# Altium schematic sheet Main_line_in.SchDoc
size A4
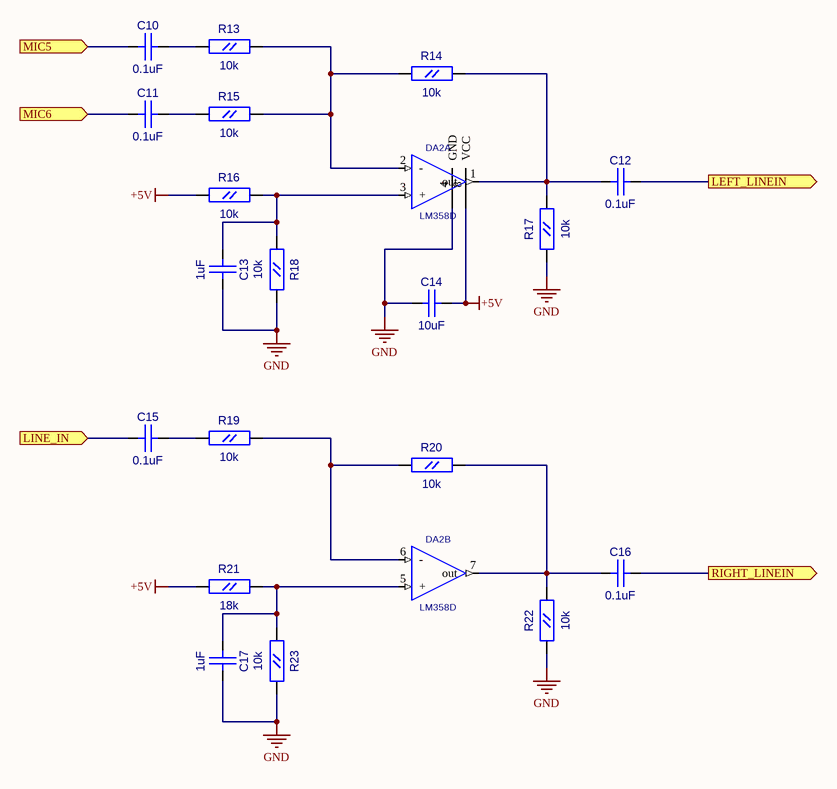
[diagram p0: Main_line_in.SchDoc]

## Parts
C10  0.1uF  [CC0603]
C11  0.1uF  [CC0603]
C12  0.1uF  [CC0603]
C13  1uF  [CC0603]
C14  10uF  [CC0805]
C15  0.1uF  [CC0603]
C16  0.1uF  [CC0603]
C17  1uF  [CC0603]
DA2  LM358D  [SO-8]  (parts A,B of 2)
R13  10k  [RC0603]
R14  10k  [RC0603]
R15  10k  [RC0603]
R16  10k  [RC0603]
R17  10k  [RC0603]
R18  10k  [RC0603]
R19  10k  [RC0603]
R20  10k  [RC0603]
R21  18k  [RC0603]
R22  10k  [RC0603]
R23  10k  [RC0603]

## Ports
LEFT_LINEIN (out), LINE_IN (in), MIC5 (in), MIC6 (in), RIGHT_LINEIN (out)

## Nets
+5V: C14.2(B) DA2.8(VCC) R16.1(A) R21.1(A)
GND: C13.2(B) C14.1(A) C17.2(B) DA2.4(GND) R17.1(A) R18.2(B) R22.1(A) R23.2(B)
LEFT_LINEIN: C12.2(B) ; port LEFT_LINEIN
LINE_IN: C15.1(A) ; port LINE_IN
MIC5: C10.1(A) ; port MIC5
MIC6: C11.1(A) ; port MIC6
RIGHT_LINEIN: C16.2(B) ; port RIGHT_LINEIN
NetC10_2: C10.2(B) R13.1(A)
NetC11_2: C11.2(B) R15.1(A)
NetC12_1: C12.1(A) DA2.1(out) R14.2(B) R17.2(B)
NetC13_1: C13.1(A) DA2.3(+) R16.2(B) R18.1(A)
NetC15_2: C15.2(B) R19.1(A)
NetC16_1: C16.1(A) DA2.7(out) R20.2(B) R22.2(B)
NetC17_1: C17.1(A) DA2.5(+) R21.2(B) R23.1(A)
NetDA2_2: DA2.2(-) R13.2(B) R14.1(A) R15.2(B)
NetDA2_6: DA2.6(-) R19.2(B) R20.1(A)

## Library data of the parts
C10-C13 C15-C17 = CC0603
  C10-C12 C15 C16: Value: 0.1uF
  C13 C17: Value: 1uF
C14 = CC0805: Value: 10uF
R13-R23 = RC0603
  R13-R20 R22 R23: Value: 10k
  R21: Value: 18k
DA2 = LM358D: Value: *